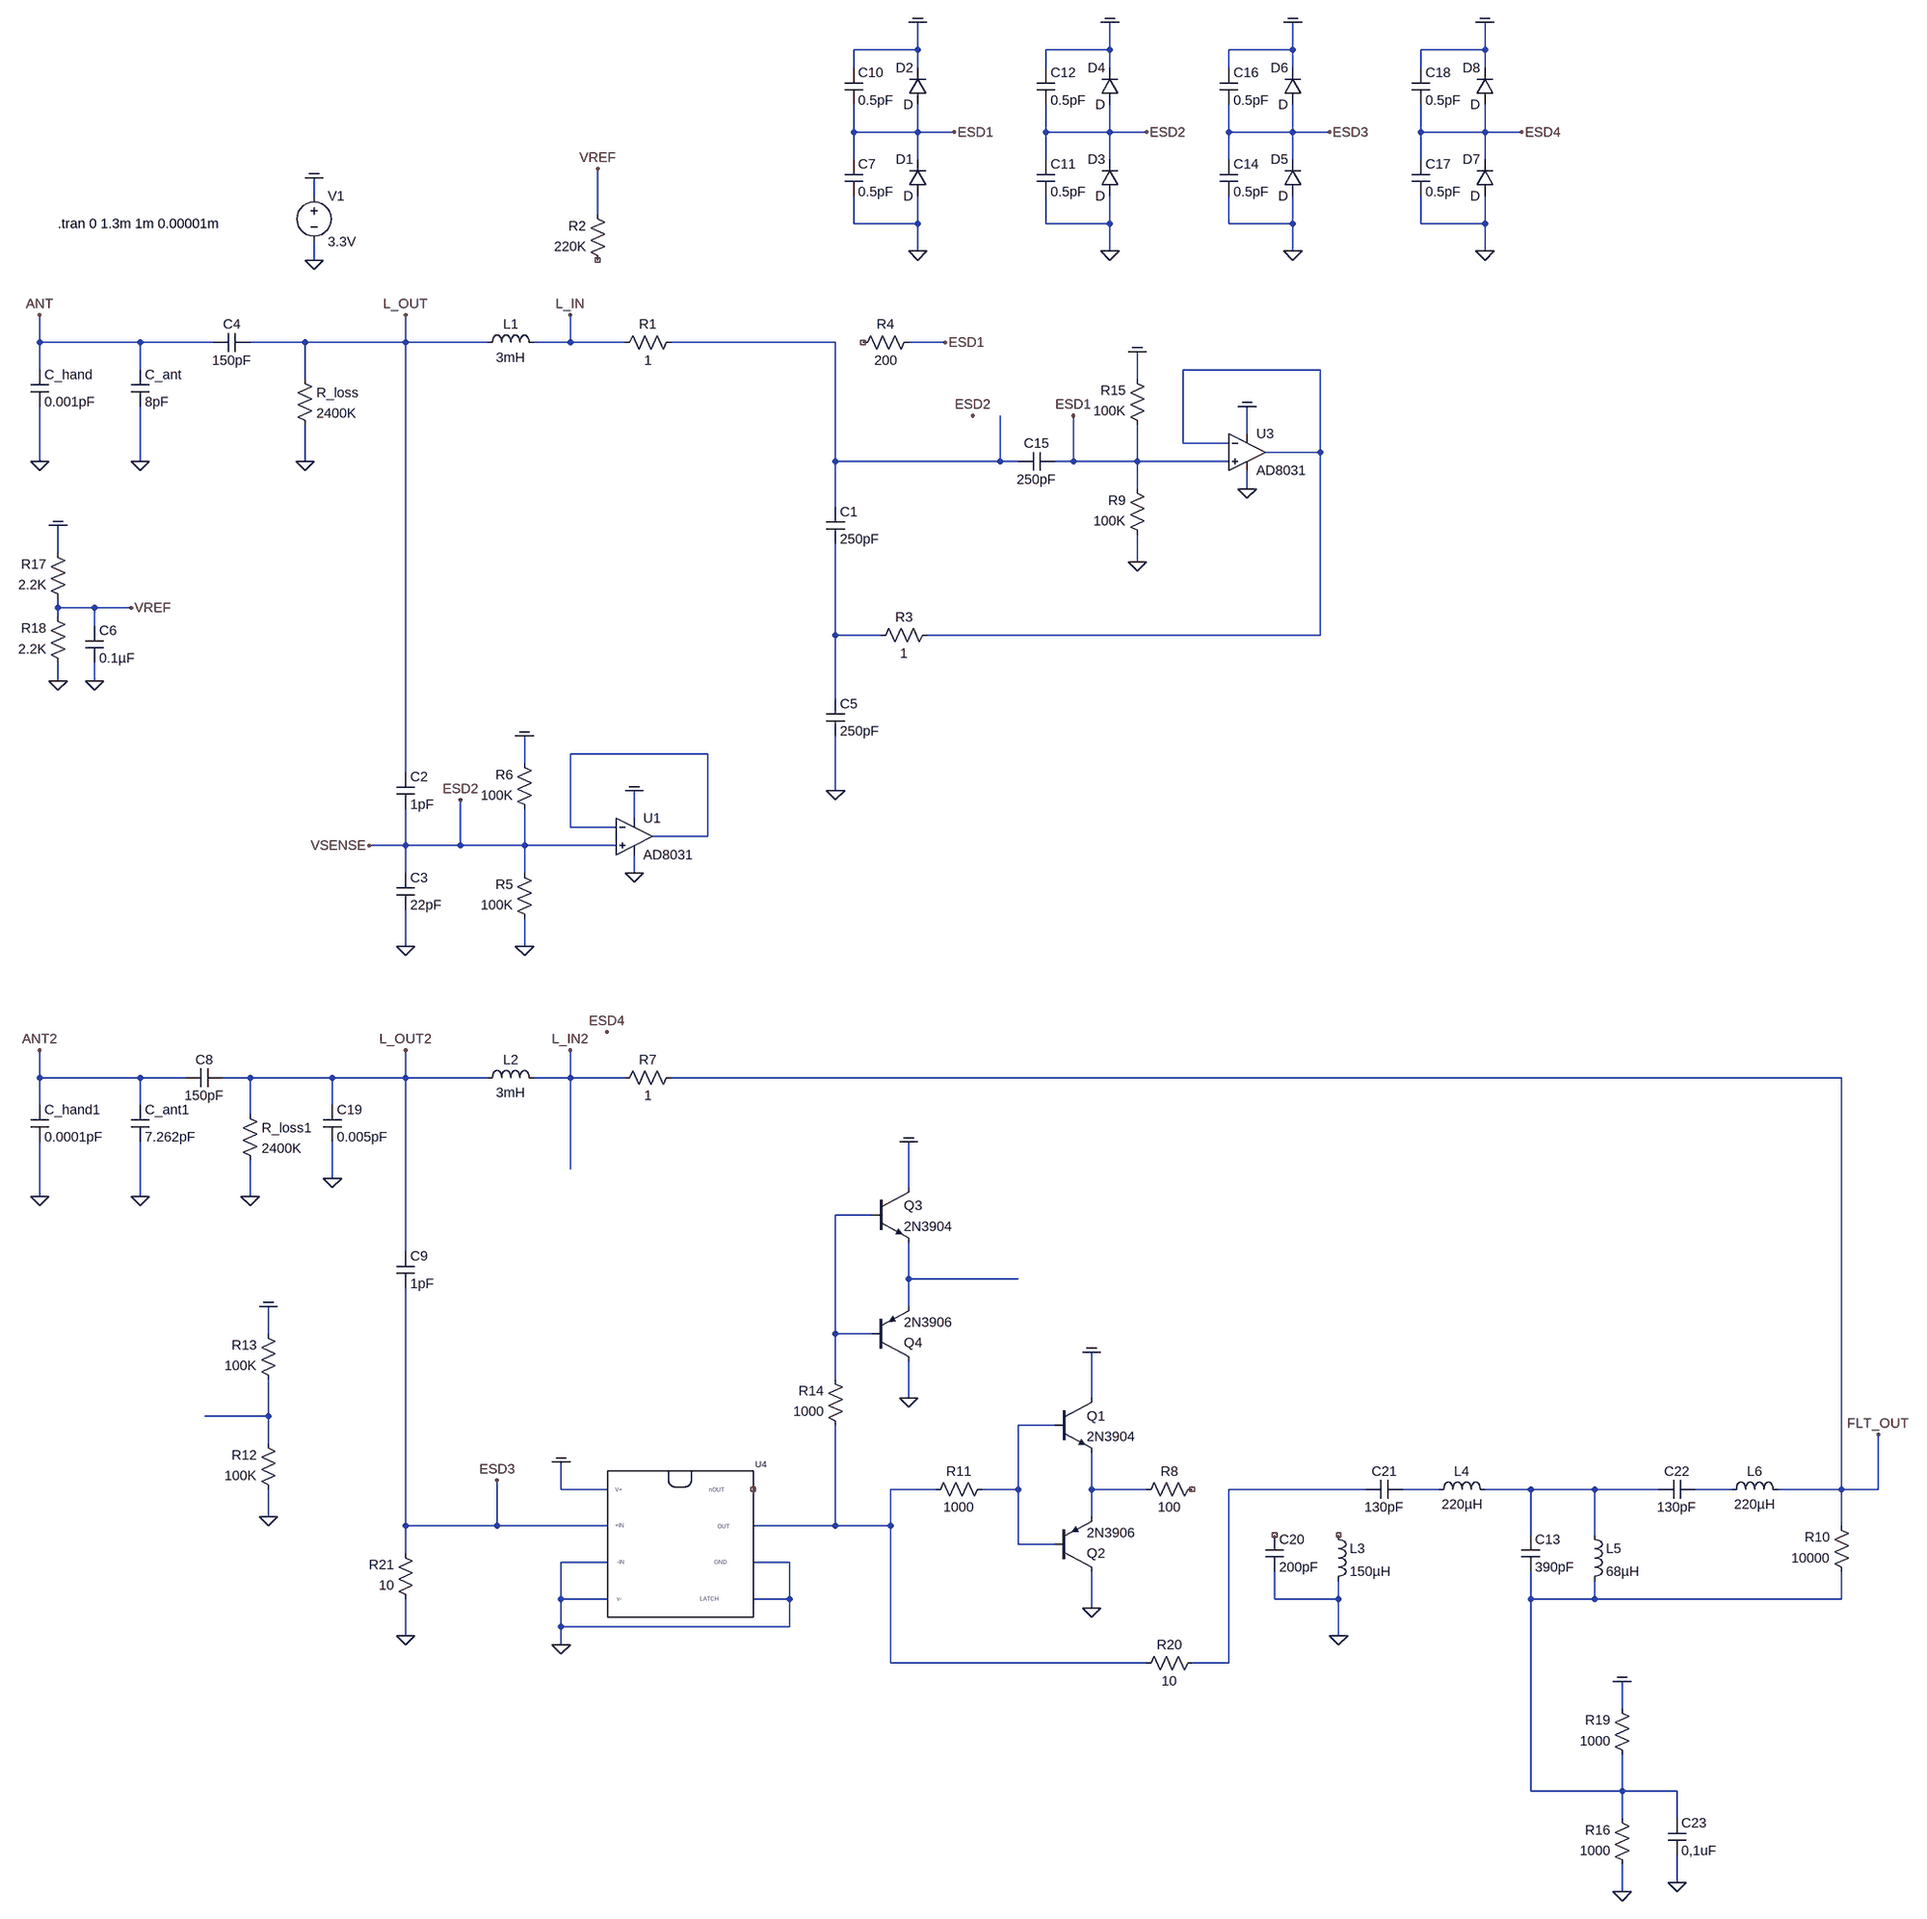
[diagram p0: schematic 2020_oscillator_experiments_v9.asc]
2020_oscillator_experiments_v9.asc, the LTspice schematic file:
Version 4
SHEET 1 3244 3076
WIRE 1056 -176 1056 -224
WIRE 1056 -176 944 -176
WIRE 1392 -176 1392 -224
WIRE 1392 -176 1280 -176
WIRE 1712 -176 1712 -224
WIRE 1712 -176 1600 -176
WIRE 2048 -176 2048 -224
WIRE 2048 -176 1936 -176
WIRE 944 -144 944 -176
WIRE 1056 -144 1056 -176
WIRE 1280 -144 1280 -176
WIRE 1392 -144 1392 -176
WIRE 1600 -144 1600 -176
WIRE 1712 -144 1712 -176
WIRE 1936 -144 1936 -176
WIRE 2048 -144 2048 -176
WIRE 944 -32 944 -80
WIRE 1056 -32 1056 -80
WIRE 1056 -32 944 -32
WIRE 1120 -32 1056 -32
WIRE 1280 -32 1280 -80
WIRE 1392 -32 1392 -80
WIRE 1392 -32 1280 -32
WIRE 1456 -32 1392 -32
WIRE 1600 -32 1600 -80
WIRE 1712 -32 1712 -80
WIRE 1712 -32 1600 -32
WIRE 1776 -32 1712 -32
WIRE 1936 -32 1936 -80
WIRE 2048 -32 2048 -80
WIRE 2048 -32 1936 -32
WIRE 2112 -32 2048 -32
WIRE 944 16 944 -32
WIRE 1056 16 1056 -32
WIRE 1280 16 1280 -32
WIRE 1392 16 1392 -32
WIRE 1600 16 1600 -32
WIRE 1712 16 1712 -32
WIRE 1936 16 1936 -32
WIRE 2048 16 2048 -32
WIRE 0 80 0 48
WIRE 496 112 496 32
WIRE 944 128 944 80
WIRE 1056 128 1056 80
WIRE 1056 128 944 128
WIRE 1280 128 1280 80
WIRE 1392 128 1392 80
WIRE 1392 128 1280 128
WIRE 1600 128 1600 80
WIRE 1712 128 1712 80
WIRE 1712 128 1600 128
WIRE 1936 128 1936 80
WIRE 2048 128 2048 80
WIRE 2048 128 1936 128
WIRE 1056 176 1056 128
WIRE 1392 176 1392 128
WIRE 1712 176 1712 128
WIRE 2048 176 2048 128
WIRE 0 192 0 160
WIRE -480 336 -480 288
WIRE -304 336 -480 336
WIRE -176 336 -304 336
WIRE -16 336 -112 336
WIRE 160 336 160 288
WIRE 160 336 -16 336
WIRE 304 336 160 336
WIRE 448 336 448 288
WIRE 448 336 384 336
WIRE 544 336 448 336
WIRE 912 336 624 336
WIRE 1104 336 1040 336
WIRE -480 384 -480 336
WIRE -304 384 -304 336
WIRE 1760 384 1520 384
WIRE -16 400 -16 336
WIRE 1440 400 1440 352
WIRE 1632 496 1632 448
WIRE 1520 512 1520 384
WIRE 1600 512 1520 512
WIRE 1760 528 1760 384
WIRE 1760 528 1664 528
WIRE -480 544 -480 448
WIRE -304 544 -304 448
WIRE -16 544 -16 480
WIRE 912 544 912 336
WIRE 1200 544 1200 464
WIRE 1200 544 912 544
WIRE 1232 544 1200 544
WIRE 1328 544 1328 464
WIRE 1328 544 1296 544
WIRE 1440 544 1440 480
WIRE 1440 544 1328 544
WIRE 1600 544 1440 544
WIRE 1440 592 1440 544
WIRE 1632 592 1632 560
WIRE 912 624 912 544
WIRE -448 704 -448 656
WIRE 1440 720 1440 672
WIRE -448 800 -448 784
WIRE -384 800 -448 800
WIRE -320 800 -384 800
WIRE -448 816 -448 800
WIRE -384 832 -384 800
WIRE 912 848 912 688
WIRE 992 848 912 848
WIRE 1760 848 1760 528
WIRE 1760 848 1072 848
WIRE -448 928 -448 896
WIRE -384 928 -384 896
WIRE 912 960 912 848
WIRE 688 1056 448 1056
WIRE 368 1072 368 1024
WIRE 160 1088 160 336
WIRE 912 1120 912 1024
WIRE 560 1168 560 1120
WIRE 448 1184 448 1056
WIRE 528 1184 448 1184
WIRE 688 1200 688 1056
WIRE 688 1200 592 1200
WIRE 160 1216 160 1152
WIRE 160 1216 96 1216
WIRE 256 1216 256 1136
WIRE 256 1216 160 1216
WIRE 368 1216 368 1152
WIRE 368 1216 256 1216
WIRE 528 1216 368 1216
WIRE 160 1264 160 1216
WIRE 368 1264 368 1216
WIRE 560 1264 560 1232
WIRE 160 1392 160 1328
WIRE 368 1392 368 1344
WIRE -480 1632 -480 1584
WIRE -304 1632 -480 1632
WIRE -224 1632 -304 1632
WIRE -112 1632 -160 1632
WIRE 32 1632 -112 1632
WIRE 160 1632 160 1584
WIRE 160 1632 32 1632
WIRE 304 1632 160 1632
WIRE 448 1632 448 1584
WIRE 448 1632 384 1632
WIRE 544 1632 448 1632
WIRE 2672 1632 624 1632
WIRE -480 1680 -480 1632
WIRE -304 1680 -304 1632
WIRE 32 1680 32 1632
WIRE -112 1696 -112 1632
WIRE 448 1792 448 1632
WIRE 32 1808 32 1744
WIRE 1040 1824 1040 1744
WIRE -480 1840 -480 1744
WIRE -304 1840 -304 1744
WIRE -112 1840 -112 1776
WIRE 976 1872 912 1872
WIRE 160 1936 160 1632
WIRE 1040 1984 1040 1920
WIRE 1232 1984 1040 1984
WIRE 1040 2032 1040 1984
WIRE -80 2080 -80 2032
WIRE 912 2080 912 1872
WIRE 976 2080 912 2080
WIRE 912 2160 912 2080
WIRE 1040 2192 1040 2128
WIRE 1360 2192 1360 2112
WIRE -80 2224 -80 2160
WIRE -80 2224 -192 2224
WIRE 1296 2240 1232 2240
WIRE -80 2272 -80 2224
WIRE 432 2352 432 2304
WIRE 512 2352 432 2352
WIRE 1088 2352 1008 2352
WIRE 1232 2352 1232 2240
WIRE 1232 2352 1168 2352
WIRE 1360 2352 1360 2288
WIRE 1456 2352 1360 2352
WIRE 1840 2352 1600 2352
WIRE 1968 2352 1904 2352
WIRE 2128 2352 2048 2352
WIRE 2240 2352 2128 2352
WIRE 2352 2352 2240 2352
WIRE 2480 2352 2416 2352
WIRE 2672 2352 2672 1632
WIRE 2672 2352 2560 2352
WIRE 2736 2352 2736 2256
WIRE 2736 2352 2672 2352
WIRE -80 2400 -80 2352
WIRE 1360 2400 1360 2352
WIRE 160 2416 160 2000
WIRE 320 2416 320 2336
WIRE 320 2416 160 2416
WIRE 512 2416 320 2416
WIRE 912 2416 912 2240
WIRE 912 2416 768 2416
WIRE 1008 2416 1008 2352
WIRE 1008 2416 912 2416
WIRE 2672 2416 2672 2352
WIRE 2128 2432 2128 2352
WIRE 2240 2432 2240 2352
WIRE 1232 2448 1232 2352
WIRE 1296 2448 1232 2448
WIRE 160 2464 160 2416
WIRE 512 2480 432 2480
WIRE 832 2480 768 2480
WIRE 432 2544 432 2480
WIRE 512 2544 432 2544
WIRE 832 2544 832 2480
WIRE 832 2544 768 2544
WIRE 1680 2544 1680 2496
WIRE 1792 2544 1792 2512
WIRE 1792 2544 1680 2544
WIRE 2128 2544 2128 2496
WIRE 2240 2544 2240 2512
WIRE 2240 2544 2128 2544
WIRE 2672 2544 2672 2496
WIRE 2672 2544 2240 2544
WIRE 1360 2560 1360 2496
WIRE 432 2592 432 2544
WIRE 832 2592 832 2544
WIRE 832 2592 432 2592
WIRE 160 2608 160 2544
WIRE 1792 2608 1792 2544
WIRE 432 2624 432 2592
WIRE 1008 2656 1008 2416
WIRE 1456 2656 1008 2656
WIRE 1600 2656 1600 2352
WIRE 1600 2656 1536 2656
WIRE 2288 2736 2288 2688
WIRE 2128 2880 2128 2544
WIRE 2288 2880 2288 2816
WIRE 2288 2880 2128 2880
WIRE 2384 2880 2288 2880
WIRE 2288 2928 2288 2880
WIRE 2384 2928 2384 2880
WIRE 2384 3040 2384 2992
WIRE 2288 3056 2288 3008
FLAG 0 192 0
FLAG 0 48 COM
FLAG -480 288 ANT
FLAG -480 544 0
FLAG -304 544 0
FLAG 160 1392 0
FLAG -16 544 0
FLAG 96 1216 VSENSE
FLAG 448 288 L_IN
FLAG 160 288 L_OUT
FLAG -448 928 0
FLAG -448 656 COM
FLAG -384 928 0
FLAG -320 800 VREF
FLAG 496 32 VREF
FLAG 1440 720 0
FLAG 1632 448 COM
FLAG 1632 592 0
FLAG 1440 352 COM
FLAG 1056 176 0
FLAG 1056 -224 COM
FLAG 1120 -32 ESD1
FLAG 1104 336 ESD1
FLAG 1392 176 0
FLAG 1392 -224 COM
FLAG 1456 -32 ESD2
FLAG 1152 464 ESD2
FLAG 912 1120 0
FLAG 1328 464 ESD1
FLAG 368 1392 0
FLAG 560 1120 COM
FLAG 560 1264 0
FLAG 368 1024 COM
FLAG 256 1136 ESD2
FLAG -480 1584 ANT2
FLAG -480 1840 0
FLAG -304 1840 0
FLAG -112 1840 0
FLAG 448 1584 L_IN2
FLAG 160 1584 L_OUT2
FLAG 160 2608 0
FLAG -80 2400 0
FLAG -80 2032 COM
FLAG 320 2336 ESD3
FLAG 1712 176 0
FLAG 1712 -224 COM
FLAG 1776 -32 ESD3
FLAG 2048 176 0
FLAG 2048 -224 COM
FLAG 2112 -32 ESD4
FLAG 32 1808 0
FLAG 432 2624 0
FLAG 432 2304 COM
FLAG 2736 2256 FLT_OUT
FLAG 1792 2608 0
FLAG 512 1552 ESD4
FLAG 1360 2560 0
FLAG 1360 2112 COM
FLAG 1040 2192 0
FLAG 1040 1744 COM
FLAG 2288 3056 0
FLAG 2288 2688 COM
FLAG 2384 3040 0
SYMBOL voltage 0 64 R0
WINDOW 123 0 0 Left 0
WINDOW 39 0 0 Left 0
SYMATTR InstName V1
SYMATTR Value 3.3V
SYMBOL ind 288 352 R270
WINDOW 0 32 56 VTop 2
WINDOW 3 5 56 VBottom 2
SYMATTR InstName L1
SYMATTR Value 3mH
SYMATTR SpiceLine Rser=120 Rpar=20Meg
SYMBOL cap 896 624 R0
SYMATTR InstName C1
SYMATTR Value 250pF
SYMBOL cap 144 1088 R0
SYMATTR InstName C2
SYMATTR Value 1pF
SYMBOL cap 144 1264 R0
SYMATTR InstName C3
SYMATTR Value 22pF
SYMBOL cap -320 384 R0
SYMATTR InstName C_ant
SYMATTR Value 8pF
SYMBOL cap -496 384 R0
SYMATTR InstName C_hand
SYMATTR Value 0.001pF
SYMBOL cap -112 320 R90
WINDOW 0 0 32 VBottom 2
WINDOW 3 32 32 VTop 2
SYMATTR InstName C4
SYMATTR Value 150pF
SYMBOL res -32 384 R0
SYMATTR InstName R_loss
SYMATTR Value 2400K
SYMBOL res 640 320 R90
WINDOW 0 0 56 VBottom 2
WINDOW 3 32 56 VTop 2
SYMATTR InstName R1
SYMATTR Value 1
SYMBOL res 512 208 R180
WINDOW 0 36 76 Left 2
WINDOW 3 36 40 Left 2
SYMATTR InstName R2
SYMATTR Value 220K
SYMBOL res -432 800 R180
WINDOW 0 36 76 Left 2
WINDOW 3 36 40 Left 2
SYMATTR InstName R17
SYMATTR Value 2.2K
SYMBOL res -432 912 R180
WINDOW 0 36 76 Left 2
WINDOW 3 36 40 Left 2
SYMATTR InstName R18
SYMATTR Value 2.2K
SYMBOL cap -400 832 R0
SYMATTR InstName C6
SYMATTR Value 0.1µF
SYMBOL res 1456 688 R180
WINDOW 0 36 76 Left 2
WINDOW 3 36 40 Left 2
SYMATTR InstName R9
SYMATTR Value 100K
SYMBOL Opamps\\AD8031 1632 464 R0
SYMATTR InstName U3
SYMBOL cap 896 960 R0
SYMATTR InstName C5
SYMATTR Value 250pF
SYMBOL res 1456 496 R180
WINDOW 0 36 76 Left 2
WINDOW 3 36 40 Left 2
SYMATTR InstName R15
SYMATTR Value 100K
SYMBOL res 976 864 R270
WINDOW 0 32 56 VTop 2
WINDOW 3 0 56 VBottom 2
SYMATTR InstName R3
SYMATTR Value 1
SYMBOL diode 1072 80 R180
WINDOW 0 24 64 Left 2
WINDOW 3 24 0 Left 2
SYMATTR InstName D1
SYMBOL diode 1072 -80 R180
WINDOW 0 24 64 Left 2
WINDOW 3 24 0 Left 2
SYMATTR InstName D2
SYMBOL res 1056 320 R90
WINDOW 0 0 56 VBottom 2
WINDOW 3 32 56 VTop 2
SYMATTR InstName R4
SYMATTR Value 200
SYMBOL cap 928 16 R0
SYMATTR InstName C7
SYMATTR Value 0.5pF
SYMBOL cap 928 -144 R0
SYMATTR InstName C10
SYMATTR Value 0.5pF
SYMBOL diode 1408 80 R180
WINDOW 0 24 64 Left 2
WINDOW 3 24 0 Left 2
SYMATTR InstName D3
SYMBOL diode 1408 -80 R180
WINDOW 0 24 64 Left 2
WINDOW 3 24 0 Left 2
SYMATTR InstName D4
SYMBOL cap 1264 16 R0
SYMATTR InstName C11
SYMATTR Value 0.5pF
SYMBOL cap 1264 -144 R0
SYMATTR InstName C12
SYMATTR Value 0.5pF
SYMBOL cap 1296 528 R90
WINDOW 0 0 32 VBottom 2
WINDOW 3 32 32 VTop 2
SYMATTR InstName C15
SYMATTR Value 250pF
SYMBOL res 384 1360 R180
WINDOW 0 36 76 Left 2
WINDOW 3 36 40 Left 2
SYMATTR InstName R5
SYMATTR Value 100K
SYMBOL Opamps\\AD8031 560 1136 R0
SYMATTR InstName U1
SYMBOL res 384 1168 R180
WINDOW 0 36 76 Left 2
WINDOW 3 36 40 Left 2
SYMATTR InstName R6
SYMATTR Value 100K
SYMBOL ind 288 1648 R270
WINDOW 0 32 56 VTop 2
WINDOW 3 5 56 VBottom 2
SYMATTR InstName L2
SYMATTR Value 3mH
SYMATTR SpiceLine Rser=120 Rpar=20Meg
SYMBOL cap -320 1680 R0
SYMATTR InstName C_ant1
SYMATTR Value 7.262pF
SYMBOL cap -496 1680 R0
SYMATTR InstName C_hand1
SYMATTR Value 0.0001pF
SYMBOL cap -160 1616 R90
WINDOW 0 0 32 VBottom 2
WINDOW 3 32 32 VTop 2
SYMATTR InstName C8
SYMATTR Value 150pF
SYMBOL res -128 1680 R0
SYMATTR InstName R_loss1
SYMATTR Value 2400K
SYMBOL res 640 1616 R90
WINDOW 0 0 56 VBottom 2
WINDOW 3 32 56 VTop 2
SYMATTR InstName R7
SYMATTR Value 1
SYMBOL cap 144 1936 R0
SYMATTR InstName C9
SYMATTR Value 1pF
SYMBOL res -64 2368 R180
WINDOW 0 36 76 Left 2
WINDOW 3 36 40 Left 2
SYMATTR InstName R12
SYMATTR Value 100K
SYMBOL res -64 2176 R180
WINDOW 0 36 76 Left 2
WINDOW 3 36 40 Left 2
SYMATTR InstName R13
SYMATTR Value 100K
SYMBOL diode 1728 80 R180
WINDOW 0 24 64 Left 2
WINDOW 3 24 0 Left 2
SYMATTR InstName D5
SYMBOL diode 1728 -80 R180
WINDOW 0 24 64 Left 2
WINDOW 3 24 0 Left 2
SYMATTR InstName D6
SYMBOL cap 1584 16 R0
SYMATTR InstName C14
SYMATTR Value 0.5pF
SYMBOL cap 1584 -144 R0
SYMATTR InstName C16
SYMATTR Value 0.5pF
SYMBOL diode 2064 80 R180
WINDOW 0 24 64 Left 2
WINDOW 3 24 0 Left 2
SYMATTR InstName D7
SYMBOL diode 2064 -80 R180
WINDOW 0 24 64 Left 2
WINDOW 3 24 0 Left 2
SYMATTR InstName D8
SYMBOL cap 1920 16 R0
SYMATTR InstName C17
SYMATTR Value 0.5pF
SYMBOL cap 1920 -144 R0
SYMATTR InstName C18
SYMATTR Value 0.5pF
SYMBOL cap 16 1680 R0
SYMATTR InstName C19
SYMATTR Value 0.005pF
SYMBOL res 176 2560 R180
WINDOW 0 36 76 Left 2
WINDOW 3 36 40 Left 2
SYMATTR InstName R21
SYMATTR Value 10
SYMBOL ad8611 640 2448 R0
SYMATTR InstName U4
SYMBOL cap 1664 2432 R0
SYMATTR InstName C20
SYMATTR Value 200pF
SYMBOL cap 1904 2336 R90
WINDOW 0 0 32 VBottom 2
WINDOW 3 32 32 VTop 2
SYMATTR InstName C21
SYMATTR Value 130pF
SYMBOL ind 1776 2416 R0
SYMATTR InstName L3
SYMATTR Value 150µH
SYMATTR SpiceLine Rser=1
SYMBOL ind 1952 2368 R270
WINDOW 0 32 56 VTop 2
WINDOW 3 5 56 VBottom 2
SYMATTR InstName L4
SYMATTR Value 220µH
SYMATTR SpiceLine Rser=10
SYMBOL res 1552 2336 R90
WINDOW 0 0 56 VBottom 2
WINDOW 3 32 56 VTop 2
SYMATTR InstName R8
SYMATTR Value 100
SYMBOL res 2688 2512 R180
WINDOW 0 36 76 Left 2
WINDOW 3 36 40 Left 2
SYMATTR InstName R10
SYMATTR Value 10000
SYMBOL cap 2112 2432 R0
SYMATTR InstName C13
SYMATTR Value 390pF
SYMBOL ind 2224 2416 R0
SYMATTR InstName L5
SYMATTR Value 68µH
SYMATTR SpiceLine Rser=1
SYMBOL npn 1296 2192 R0
SYMATTR InstName Q1
SYMATTR Value 2N3904
SYMBOL pnp 1296 2496 M180
SYMATTR InstName Q2
SYMATTR Value 2N3906
SYMBOL npn 976 1824 R0
SYMATTR InstName Q3
SYMATTR Value 2N3904
SYMBOL pnp 976 2128 M180
SYMATTR InstName Q4
SYMATTR Value 2N3906
SYMBOL cap 2416 2336 R90
WINDOW 0 0 32 VBottom 2
WINDOW 3 32 32 VTop 2
SYMATTR InstName C22
SYMATTR Value 130pF
SYMBOL ind 2464 2368 R270
WINDOW 0 32 56 VTop 2
WINDOW 3 5 56 VBottom 2
SYMATTR InstName L6
SYMATTR Value 220µH
SYMATTR SpiceLine Rser=10
SYMBOL res 1184 2336 R90
WINDOW 0 0 56 VBottom 2
WINDOW 3 32 56 VTop 2
SYMATTR InstName R11
SYMATTR Value 1000
SYMBOL res 928 2256 R180
WINDOW 0 36 76 Left 2
WINDOW 3 36 40 Left 2
SYMATTR InstName R14
SYMATTR Value 1000
SYMBOL res 2304 3024 R180
WINDOW 0 36 76 Left 2
WINDOW 3 36 40 Left 2
SYMATTR InstName R16
SYMATTR Value 1000
SYMBOL res 2304 2832 R180
WINDOW 0 36 76 Left 2
WINDOW 3 36 40 Left 2
SYMATTR InstName R19
SYMATTR Value 1000
SYMBOL cap 2368 2928 R0
SYMATTR InstName C23
SYMATTR Value 0,1uF
SYMBOL res 1552 2640 R90
WINDOW 0 0 56 VBottom 2
WINDOW 3 32 56 VTop 2
SYMATTR InstName R20
SYMATTR Value 10
TEXT -448 128 Left 2 !.tran 0 1.3m 1m 0.00001m

The netlist it stands for:
* 2020_oscillator_experiments_v9.asc
V1 COM 0 3.3V
L1 L_OUT L_IN 3mH Rser=120 Rpar=20Meg
C1 N001 N003 250pF
C2 L_OUT ESD2 1pF
C3 ESD2 0 22pF
C_ant ANT 0 8pF
C_hand ANT 0 0.001pF
C4 L_OUT ANT 150pF
R_loss L_OUT 0 2400K
R1 N001 L_IN 1
R2 NC_01 VREF 220K
R17 VREF COM 2.2K
R18 0 VREF 2.2K
C6 VREF 0 0.1µF
R9 0 ESD1 100K
XU3 ESD1 N002 COM 0 N002 AD8031  ; pins In+ In- V+ V- OUT
C5 N003 0 250pF
R15 ESD1 COM 100K
R3 N003 N002 1
D1 0 ESD1 D
D2 ESD1 COM D
R4 ESD1 NC_02 200
C7 ESD1 0 0.5pF
C10 COM ESD1 0.5pF
D3 0 ESD2 D
D4 ESD2 COM D
C11 ESD2 0 0.5pF
C12 COM ESD2 0.5pF
C15 ESD1 N001 250pF
R5 0 ESD2 100K
XU1 ESD2 N004 COM 0 N004 AD8031  ; pins In+ In- V+ V- OUT
R6 ESD2 COM 100K
L2 L_OUT2 L_IN2 3mH Rser=120 Rpar=20Meg
C_ant1 ANT2 0 7.262pF
C_hand1 ANT2 0 0.0001pF
C8 L_OUT2 ANT2 150pF
R_loss1 L_OUT2 0 2400K
R7 FLT_OUT L_IN2 1
C9 L_OUT2 ESD3 1pF
R12 0 N007 100K
R13 N007 COM 100K
D5 0 ESD3 D
D6 ESD3 COM D
C14 ESD3 0 0.5pF
C16 COM ESD3 0.5pF
D7 0 ESD4 D
D8 ESD4 COM D
C17 ESD4 0 0.5pF
C18 COM ESD4 0.5pF
C19 L_OUT2 0 0.005pF
R21 0 ESD3 10
XU4 ESD3 0 COM 0 0 0 N009 NC_03 ad8611  ; pins +IN -IN V+ V- Latch GND OUT nOUT
C20 NC_04 0 200pF
C21 N012 N011 130pF
L3 NC_05 0 150µH Rser=1
L4 N012 N013 220µH Rser=10
R8 NC_06 N010 100
R10 N015 FLT_OUT 10000
C13 N013 N015 390pF
L5 N013 N015 68µH Rser=1
Q1 COM N008 N010 0 2N3904
Q2 0 N008 N010 0 2N3906
Q3 COM N005 N006 0 2N3904
Q4 0 N005 N006 0 2N3906
C22 N014 N013 130pF
L6 N014 FLT_OUT 220µH Rser=10
R11 N008 N009 1000
R14 N009 N005 1000
R16 0 N015 1000
R19 N015 COM 1000
C23 N015 0 0,1uF
R20 N011 N009 10
.model D D
.lib standard.dio
.model NPN NPN
.model PNP PNP
.lib standard.bjt
.tran 0 1.3m 1m 0.00001m
.lib AD8611.cir
.backanno
.end